# Altium schematic sheet CABLE_TEST.SchDoc
size A3; SheetNumber: 1; SheetTotal: 8
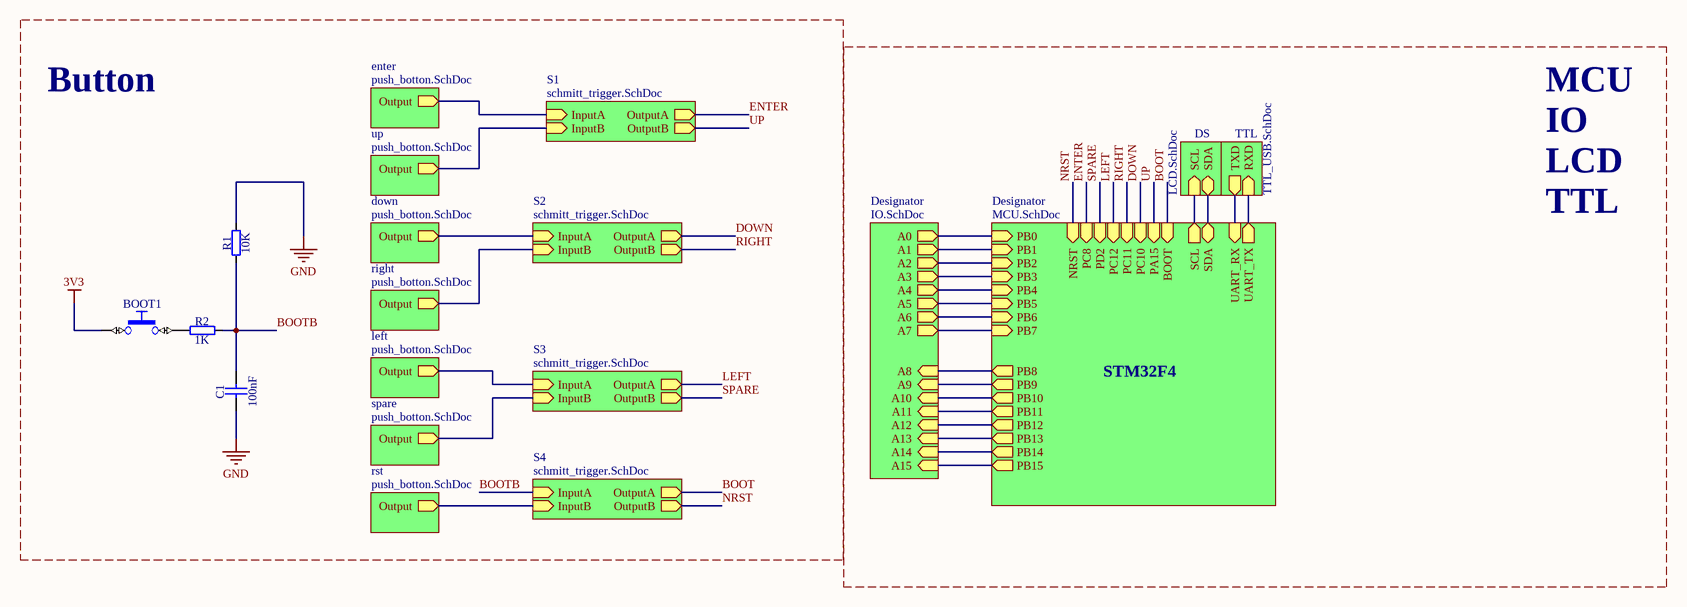
[diagram p0: CABLE_TEST.SchDoc]

## Parts
BOOT1  Push Button  [PB_TYCO_FSMSM]  (value not drawn)
C1  100nF  [CAPC2012X135N]
R1  10K  [RESC2012X60N]
R2  1K  [RESC2012X60N]

## Blocks framed on the sheet
Button: BOOT1 C1 R1 R2

## Sub-sheets
Designator = MCU.SchDoc: PB0 (in), PB1 (in), PB2 (in), PB3 (in), PB4 (in), PB5 (in), PB6 (in), PB7 (in), PB8 (out), PB10 (out), PB11 (out), PB12 (out), PB13 (out), PB14 (out), PB15 (out), PB9 (out), SCL (out), SDA (bidir), UART_RX (in), UART_TX (out), PD2 (in), PC12 (in), PC11 (in), PC10 (in), PA15 (in), PC8 (in), NRST (in), BOOT (in)
Designator = IO.SchDoc: A0 (out), A1 (out), A2 (out), A3 (out), A4 (out), A5 (out), A6 (out), A7 (out), A8 (in), A9 (in), A10 (in), A11 (in), A12 (in), A13 (in), A14 (in), A15 (in)
down = push_botton.SchDoc: Output (out)
DS = LCD.SchDoc: SCL (in), SDA (bidir)
enter = push_botton.SchDoc: Output (out)
left = push_botton.SchDoc: Output (out)
right = push_botton.SchDoc: Output (out)
rst = push_botton.SchDoc: Output (out)
S1 = schmitt_trigger.SchDoc: InputA (in), InputB (in), OutputA (out), OutputB (out)
S2 = schmitt_trigger.SchDoc: InputA (in), InputB (in), OutputA (out), OutputB (out)
S3 = schmitt_trigger.SchDoc: InputA (in), InputB (in), OutputA (out), OutputB (out)
S4 = schmitt_trigger.SchDoc: InputA (in), InputB (in), OutputA (out), OutputB (out)
spare = push_botton.SchDoc: Output (out)
TTL = TTL_USB.SchDoc: RXD (in), TXD (out)
up = push_botton.SchDoc: Output (out)

## Nets
3V3: BOOT1.1
GND: C1.1 R1.2
BOOT: sheet S4/OutputA, sheet Designator/BOOT
BOOTB: C1.2 R1.1 R2.2 ; sheet S4/InputA
DOWN: sheet S2/OutputA, sheet Designator/PC10
ENTER: sheet S1/OutputA, sheet Designator/PC8
LEFT: sheet S3/OutputA, sheet Designator/PC12
NRST: sheet S4/OutputB, sheet Designator/NRST
RIGHT: sheet S2/OutputB, sheet Designator/PC11
SPARE: sheet S3/OutputB, sheet Designator/PD2
UP: sheet S1/OutputB, sheet Designator/PA15
NetBOOT1_2: BOOT1.2 R2.1
(unnamed): sheet down/Output, sheet S2/InputA
(unnamed): sheet S1/InputA, sheet enter/Output
(unnamed): sheet S1/InputB, sheet up/Output
(unnamed): sheet left/Output, sheet S3/InputA
(unnamed): sheet right/Output, sheet S2/InputB
(unnamed): sheet spare/Output, sheet S3/InputB
(unnamed): sheet rst/Output, sheet S4/InputB
(unnamed): sheet DS/SCL, sheet Designator/SCL
(unnamed): sheet DS/SDA, sheet Designator/SDA
(unnamed): sheet TTL/RXD, sheet Designator/UART_TX
(unnamed): sheet TTL/TXD, sheet Designator/UART_RX
(unnamed): sheet Designator/PB0, sheet Designator/A0
(unnamed): sheet Designator/PB1, sheet Designator/A1
(unnamed): sheet Designator/PB2, sheet Designator/A2
(unnamed): sheet Designator/PB3, sheet Designator/A3
(unnamed): sheet Designator/PB4, sheet Designator/A4
(unnamed): sheet Designator/PB5, sheet Designator/A5
(unnamed): sheet Designator/PB6, sheet Designator/A6
(unnamed): sheet Designator/PB7, sheet Designator/A7
(unnamed): sheet Designator/PB8, sheet Designator/A8
(unnamed): sheet Designator/PB10, sheet Designator/A10
(unnamed): sheet Designator/PB11, sheet Designator/A11
(unnamed): sheet Designator/PB12, sheet Designator/A12
(unnamed): sheet Designator/PB13, sheet Designator/A13
(unnamed): sheet Designator/PB14, sheet Designator/A14
(unnamed): sheet Designator/PB15, sheet Designator/A15
(unnamed): sheet Designator/PB9, sheet Designator/A9

## Notes on the sheet
- MCU
- IO
- LCD
- TTL
- STM32F4

## Library data of the parts
BOOT1 = PB_TYCO_FSMSM: Push-Button Switch SPST; Part Description: 12VDC 50mA SPST Tactile Push-Button Switch; Manufacturer: TYCO ELECTRONICS; Manufacturer Part Number: FSMSM or 1437566-3; PressFit: No; Part Number: PB_TYCO_FSMSM; Component Kind: Standard; Component Type: Standard; Pin Count: 2; PackageDescription: Body 3.5x6.0mm, Pushbutton Switch, TYCO ALCOSWITCH FSMSM Serie; Family: Push Button; Mounted: Yes; Socket: No; SMD: Yes; Sense: No; Status: None; ComponentHeight: 4.3mm; HelpURL: \\cern.ch\dfs\Applications\Altium\Datasheets\PB_TYCO_FSMSM.pdf; Author: CERN DEM JLC; CreateDate: 6/30/2008; LatestRevisionDate: 6/21/2012
C1 = CC0805_100NF_50V_10%_X7R: Non-polarised capacitor; Part Description: SMD Multilayer Chip Ceramic Capacitor; Manufacturer: GENERIC; Manufacturer1 Part Number: C2012X7R1H104K085; Voltage: 50V; TC: X7R; Tolerance: ±10%; Part Number: CC0805_100NF_50V_10%_X7R; Component Kind: Standard; Component Type: Standard; Pin Count: 2; Value: 100nF; Status: None; Manufacturer Part Number: CC0805_100NF_50V_10%_X7R; Case: 0805; Mounted: Yes; Socket: No; SMD: Yes; Sense: No; Manufacturer1 Example: TDK; Manufacturer1 ComponentHeight: 1mm; HelpURL: \\cern.ch\dfs\Applications\Altium\Datasheets\CC0805_X7R_TDK_C.pdf; Author: CERN DEM JLC; CreateDate: 12/3/2007; LatestRevisionDate: 4/22/2015
R1 R2 = R0805_24K_1%_0.125W_100PPM: Resistor - 1%; Part Description: General Purpose Thick Film Chip Resistor; Manufacturer: GENERIC; Manufacturer1 Part Number: NRC10F2402TRF; Power: 0.125W; TC: ±100ppm/°C; PressFit: No; Part Number: R0805_24K_1%_0.125W_100PPM; Component Kind: Standard; Component Type: Standard; Pin Count: 2; Status: Preferred; Tolerance: ±1%; Manufacturer Part Number: R0805_24K_1%_0.125W_100PPM; Case: 0805; Mounted: Yes; Sense: No; Socket: No; SMD: Yes; HelpURL: \\cern.ch\dfs\Applications\Altium\Datasheets\R0805_NIC_NRC.pdf; Author: CERN DEM JLC; CreateDate: 12/3/2007; LatestRevisionDate: 3/13/2008; Manufacturer1 Example: NIC COMPONENT; Manufacturer1 ComponentHeight: 0.6mm
  R1: Value: 10K
  R2: Value: 1K